# Altium project CT_Project.PrjPcb
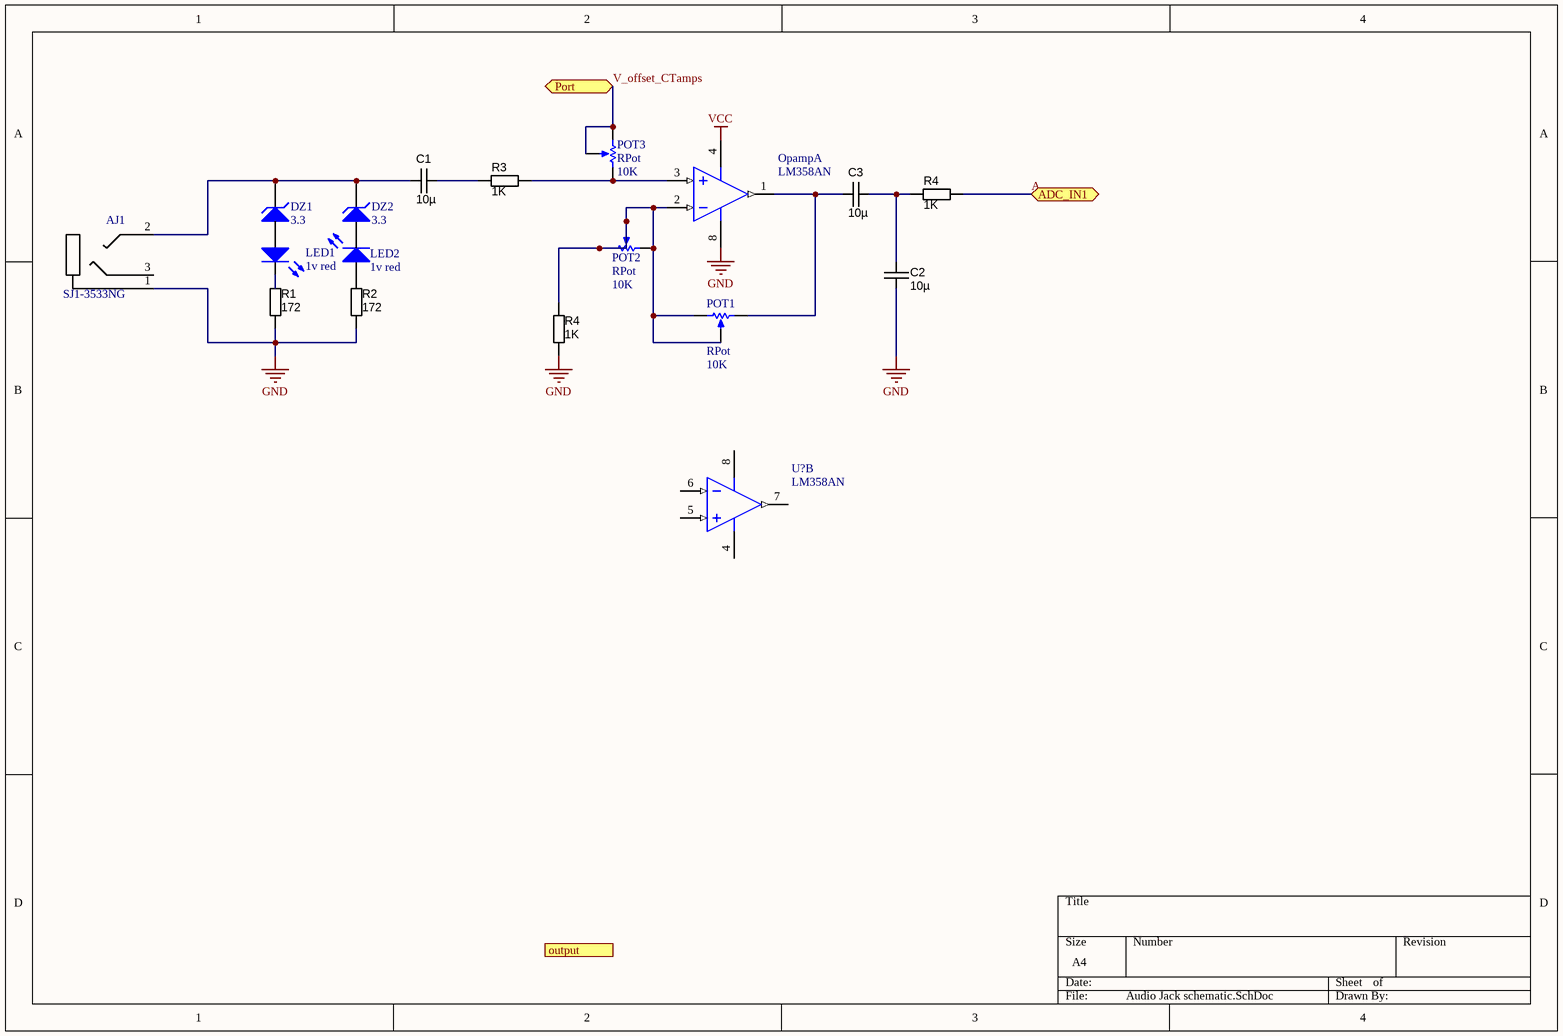
[diagram p0: Audio Jack schematic.SchDoc]
6 sheets, 38 parts. Net scope: flat (ports and power ports of the same name join across sheets).
Sheets:
  Audio Jack schematic.SchDoc
  MK20DXschematic.SchDoc
  Om Amp Level shifter schematic.SchDoc
  Open SDA schematic.SchDoc
  Power Supply schematic.SchDoc
  XBEEPROschematic.SchDoc

## Sheet Audio Jack schematic.SchDoc
size A4

### Parts
(Parts that share a designator on the sheet are numbered #1, #2 ... from top to bottom, then left to right.)
1v_red  LED2  [LED-1]
AJ1  SJ1-3533NG  [SJ1-3533NG]
C1#1  value 10µ  [CAPC2012N]  (hidden comment: approved sub OK)
C2#1  value 10µ  [CAPC2012N]  (hidden comment: approved sub OK)
C3  value 10µ  [CAPC2012N]  (hidden comment: approved sub OK)
DZ1#1  3.3  [DIODE-0.7]
DZ2  3.3  [DIODE-0.7]
LED1  1v red  [LED-1]
Opamp  LM358AN  [N08E]  (part A of 2)
POT1  RPot  value 10K  [VR5]
POT2  RPot  value 10K  [VR5]
POT3  RPot  value 10K  [VR5]
R1#1  value 172  [RESC2012N_ZERO]  (hidden comment: Thick Film)
R2#1  value 172  [RESC2012N_ZERO]  (hidden comment: Thick Film)
R3  value 1K  [RESC2012N_ZERO]  (hidden comment: Thick Film)
R4#1  value 1K  [RESC2012N_ZERO]  (hidden comment: Thick Film)
R4#2  value 1K  [RESC2012N_ZERO]  (hidden comment: Thick Film)
U?  LM358AN  [N08E]  (part B of 2)

### Ports
ADC_IN1, output, Port

### Nets
GND: AJ1.1(S) C2#1.2 Opamp.8(V+) R1#1.1 R2#1.1 R4#2.2
VCC: Opamp.4(GND)
A: R4#1.1 ; port ADC_IN1
V_offset_CTamps: POT3.1(TOP) POT3.3(TAP) ; port Port
NetAJ1_2: AJ1.2(T) C1#1.2 DZ1#1.2(K) DZ2.2(K)
NetC1#1_1: C1#1.1 R3.1
NetC2#1_1: C2#1.1 C3.2 R4#1.2
NetC3_1: C3.1 Opamp.1(OUTA) POT1.2(BOT)
NetLED1_2: LED1.2(K) R1#1.2
NetOpamp_2: Opamp.2(INA-) POT1.1(TOP) POT1.3(TAP) POT2.1(TOP) POT2.2(BOT) POT2.3(TAP) R4#2.1
NetOpamp_3: Opamp.3(INA+) POT3.2(BOT) R3.2

Not connected (* = marked no-connect by the designer): 1v_red 1(A) 2(K); AJ1 3(R); DZ1#1 1(A); DZ2 1(A); LED1 1(A); R2#1 2; U? 4(GND) 5(INB+) 6(INB-) 7(OUTB) 8(V+)

### Library data of the parts
1v_red LED1 = LED1: Typical RED GaAs LED; Published: 8-Jun-2000; LatestRevisionDate: 08-Jul-2005; LatestRevisionNote: Mech Layer 1 removed.; PackageReference: LED-1; Publisher: Altium Limited; PackageDescription: LED; 2 Leads
AJ1 = SJ1-3533NG: SJ1 Series 3.5 mm 12 V Right Angle Through Hole Isolated Stereo Audio Jack; MF: CUI; Availability: Good; Package: None; MP: SJ1-3533NG; Price: 0.77 USD; Value: *
C1#1 C2#1 C3 = CAPC_10u_0805_16V: Capacitor SMD Cer 10uF 10% 16V X7R 0805; Manufacturer 1: Samsung; Manufacturer Part Number 1: CL21B106KBN; Ratings: 16V; X7R; Material: ceramic; Package / Case: 0805 (2012 metric); Tolerance: ±10%
DZ1#1 DZ2 = D Zener: Zener Diode; Published: 8-Jun-2000; LatestRevisionDate: 17-Jul-2002; LatestRevisionNote: Re-released for DXP Platform.; PackageReference: DIODE-0.7; Publisher: Altium Limited; PackageDescription: Diode, Thru-Hole; 2 Leads; 0.7 in Pin Spacing
Opamp U? = CMP-0055-00164-2: Low Power Dual Operational Amplifier, 8-pin MDIP; Manufacturer: National Semiconductor; CompType: Amplifiers; PackageTopMarking: NSUZXYTTE#*LM*358AN; PowerWise: N; ComponentLink2Description: LM358 Web Page; Code_JEDEC: MS-001-BA; ComponentLink3Description: N08E Package Page; PinCount: 8; PackageReference: N08E; ComponentLink3URL: http://www.national.com/packaging/folders/n08e.html; PackageVersion: revG, May-2006; RevisionNote: Component URLs added; DatasheetVersion: Oct-2005; ComponentLink1URL: http://www.national.com/ds/LM/LM358.pdf; PackageDescription: MDIP, .365 x .250 x .130in, 8 Lead, .100in Pitch; ComponentLink2URL: http://www.national.com/pf/LM/LM358.html; ComponentLink1Description: LM358 Datasheet; RoHS: N
  Opamp: PartId: 1
  U?: PartId: 2
POT1-POT3 = RPot: Potentiometer; Sim Note: Enter the Resistance value and the set point into parameter fields.; Set Position: 0.5; Published: 8-Jun-2000; LatestRevisionDate: 17-Jul-2002; LatestRevisionNote: Re-released for DXP Platform.; PackageReference: VR5; Publisher: Altium Limited; PackageDescription: Variable Resistor, Thru-Hole; 3 Leads
R1#1 R2#1 R3 R4#1 R4#2 = RES_0R_0805: Resistor SMD chip 0.0 Ohm 0.125W 0805; Manufacturer 1: Rohm Semiconductor; Manufacturer Part Number 1: MCR10EZPJ000; Tolerance: ±5%; Ratings: 1/8W; Package / Case: 0805 (2012 metric)

## Sheet MK20DXschematic.SchDoc
size A4
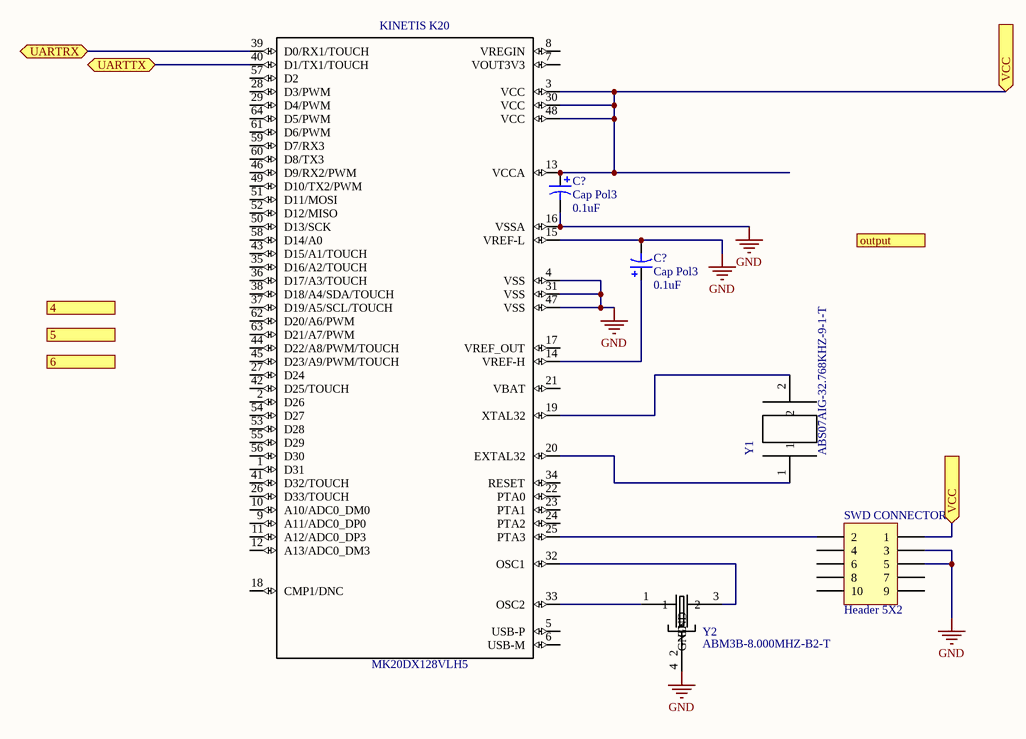
[diagram p1: MK20DXschematic.SchDoc]

### Parts
(Parts that share a designator on the sheet are numbered #1, #2 ... from top to bottom, then left to right.)
C?#1  Cap Pol3  value 0.1uF  [C0805]
C?#2  Cap Pol3  value 0.1uF  [C0805]
KINETIS_K20  MK20DX128VLH5  [QFP50P1200X1200X160-64N]
SWD_CONNECTOR  Header 5X2  [HDR2X5]
Y1  ABS07AIG-32.768KHZ-9-1-T  [XTAL320X150X90]
Y2  ABM3B-8.000MHZ-B2-T  [OSCSC500X320X110-4N]

### Ports
4, 5, 6, output, UARTRX (bidir), UARTTX (bidir), VCC (in)

### Nets
GND: C?#1.2 C?#2.2 KINETIS_K20.4(VSS) KINETIS_K20.15(VREF-L) KINETIS_K20.16(VSSA) KINETIS_K20.31(VSS) KINETIS_K20.47(VSS) SWD_CONNECTOR.3 SWD_CONNECTOR.5 Y2.4(GND)
NetC?#1_1: C?#1.1 KINETIS_K20.3(VCC) KINETIS_K20.13(VCCA) KINETIS_K20.30(VCC) KINETIS_K20.48(VCC) SWD_CONNECTOR.1 ; port VCC
NetC?#2_1: C?#2.1 KINETIS_K20.14(VREF-H)
NetKINETIS_K20_19: KINETIS_K20.19(XTAL32) Y1.2
NetKINETIS_K20_20: KINETIS_K20.20(EXTAL32) Y1.1
NetKINETIS_K20_25: KINETIS_K20.25(PTA3) SWD_CONNECTOR.2
NetKINETIS_K20_32: KINETIS_K20.32(OSC1) Y2.3(2)
NetKINETIS_K20_33: KINETIS_K20.33(OSC2) Y2.1
NetKINETIS_K20_39: KINETIS_K20.39(D0/RX1/TOUCH) ; port UARTRX
NetKINETIS_K20_40: KINETIS_K20.40(D1/TX1/TOUCH) ; port UARTTX

Not connected (* = marked no-connect by the designer): KINETIS_K20 1(D31) 2(D26) 5(USB-P) 6(USB-M) 7(VOUT3V3) 8(VREGIN) 9(A11/ADC0_DP0) 10(A10/ADC0_DM0) 11(A12/ADC0_DP3) 12(A13/ADC0_DM3) 17(VREF_OUT) 18(CMP1/DNC) 21(VBAT) 22(PTA0) 23(PTA1) 24(PTA2) 26(D33/TOUCH) 27(D24) 28(D3/PWM) 29(D4/PWM) 34(RESET) 35(D16/A2/TOUCH) 36(D17/A3/TOUCH) 37(D19/A5/SCL/TOUCH) 38(D18/A4/SDA/TOUCH) 41(D32/TOUCH) 42(D25/TOUCH) 43(D15/A1/TOUCH) 44(D22/A8/PWM/TOUCH) 45(D23/A9/PWM/TOUCH) 46(D9/RX2/PWM) 49(D10/TX2/PWM) 50(D13/SCK) 51(D11/MOSI) 52(D12/MISO) 53(D28) 54(D27) 55(D29) 56(D30) 57(D2) 58(D14/A0) 59(D7/RX3) 60(D8/TX3) 61(D6/PWM) 62(D20/A6/PWM) 63(D21/A7/PWM) 64(D5/PWM); SWD_CONNECTOR 4 6 7 8 9 10; Y2 2(GND)

### Library data of the parts
C?#1 C?#2 = Cap Pol3: Polarized Capacitor (Surface Mount); Published: 8-Jun-2000; LatestRevisionDate: 29-May-2009; LatestRevisionNote: IPC-7351 Footprint Added.; PackageReference: C0805; Publisher: Altium Limited; PackageDescription: Chip Capacitor
KINETIS_K20 = MK20DX128VLH5: MCU 32-bit Kinetis K20 ARM Cortex M4 RISC 128KB Flash 1.8V/2.5V/3.3V 64-Pin LQFP Tray; pin to pad: 17>none; MF: NXP Semiconductors; Package: LQFP-64 NXP Semiconductors; Price: 4.22 USD; MP: MK20DX128VLH5; Availability: Good; Value: *
SWD_CONNECTOR = Header 5X2: Header, 5-Pin, Dual row; LatestRevisionDate: 17-Jul-2002; LatestRevisionNote: Re-released for DXP Platform.; Publisher: Altium Limited
Y1 = ABS07AIG-32.768KHZ-9-1-T: Crystal 32.768khz 9pf Smd; MF: Abracon; MP: ABS07AIG-32.768KHZ-9-1-T; Package: SMD-2 Abracon; Availability: Good; Price: 0.53 USD; Value: *
Y2 = ABM3B-8.000MHZ-B2-T: Crystal 8MHz %C2%B120ppm %28Tol%29 %C2%B150ppm %28Stability%29 18pF FUND 200Ohm 4-Pin CSMD T/R; MF: Abracon; MP: ABM3B-8.000MHZ-B2-T; Package: SMD-4 Abracon; Availability: Good; Price: 0.45 USD; Value: *

## Sheet Om Amp Level shifter schematic.SchDoc
size A4
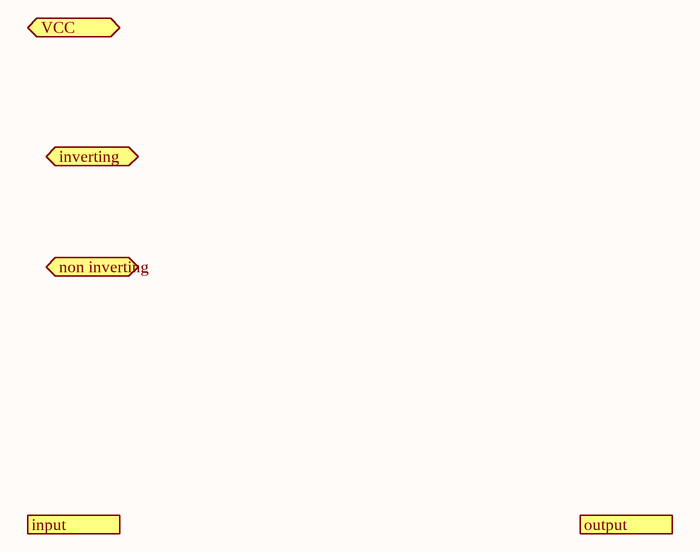
[diagram p2: Om Amp Level shifter schematic.SchDoc]

### Ports
input, inverting, non inverting, output, VCC

## Sheet Open SDA schematic.SchDoc
size A4
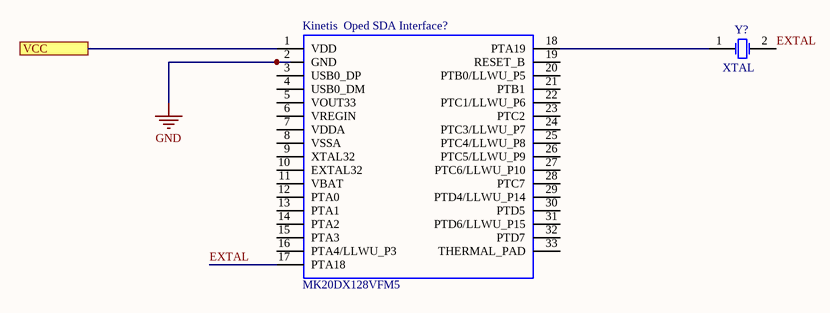
[diagram p3: Open SDA schematic.SchDoc]

### Parts
Kinetis_Oped_SDA_Interface?  MK20DX128VFM5  [SOT617-14]
Y?  XTAL  [R38]

### Ports
VCC

### Nets
GND: Kinetis_Oped_SDA_Interface?.2(GND)
EXTAL: Kinetis_Oped_SDA_Interface?.17(PTA18) Y?.2(OSC2)
NetC?#1_1: Kinetis_Oped_SDA_Interface?.1(VDD) ; port VCC
NetKinetis_Oped_SDA_Interface?_18: Kinetis_Oped_SDA_Interface?.18(PTA19) Y?.1(OSC1)

Not connected (* = marked no-connect by the designer): Kinetis_Oped_SDA_Interface? 3(USB0_DP) 4(USB0_DM) 5(VOUT33) 6(VREGIN) 7(VDDA) 8(VSSA) 9(XTAL32) 10(EXTAL32) 11(VBAT) 12(PTA0) 13(PTA1) 14(PTA2) 15(PTA3) 16(PTA4/LLWU_P3) 19(RESET_B) 20(PTB0/LLWU_P5) 21(PTB1) 22(PTC1/LLWU_P6) 23(PTC2) 24(PTC3/LLWU_P7) 25(PTC4/LLWU_P8) 26(PTC5/LLWU_P9) 27(PTC6/LLWU_P10) 28(PTC7) 29(PTD4/LLWU_P14) 30(PTD5) 31(PTD6/LLWU_P15) 32(PTD7) 33(THERMAL_PAD)

### Library data of the parts
Kinetis_Oped_SDA_Interface? = MK20DX128VFM5: MCU, Kinetis, MK20DX128VFM5, QFN32 Freescale MK20DX128VFM5, 32bit ARM Cortex M4 MCU, 50MHz, 160 kB Flash, 32-Pin QFN; Manufacturer_Name: NXP; Geometry.Height: mm; Supplier_Name: RS; RS Part Number: 8181223; Manufacturer_Part_Number: MK20DX128VFM5; Allied_Number: *; Other Part Number: *; Datasheet Link: http://www.nxp.com/docs/en/data-sheet/K20P32M50SF0.pdf; 3D Package: *
Y? = XTAL: Crystal Oscillator; Published: 8-Jun-2000; LatestRevisionDate: 17-Jul-2002; LatestRevisionNote: Re-released for DXP Platform.; PackageReference: R38; Publisher: Altium Limited; PackageDescription: Crystal, Thru-Hole; 2 Leads; Body 3.1 x 8.2 mm (Dia.xH)

## Sheet Power Supply schematic.SchDoc
size A4
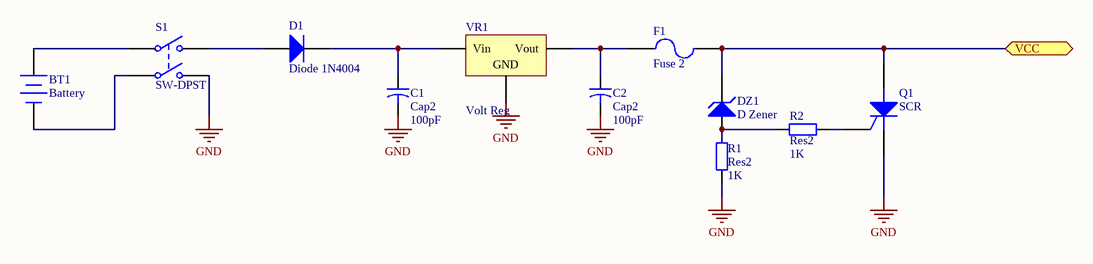
[diagram p4: Power Supply schematic.SchDoc]

### Parts
(Parts that share a designator on the sheet are numbered #1, #2 ... from top to bottom, then left to right.)
BT1  Battery  [BAT-2]
C1#2  Cap2  value 100pF  [CAPR5-4X5]
C2#2  Cap2  value 100pF  [CAPR5-4X5]
D1  Diode 1N4004  [DO-41]
DZ1#2  D Zener  [DIODE-0.7]
F1  Fuse 2  [PIN-W2/E2.8]
Q1  SCR  [TO-220-AB]
R1#2  Res2  value 1K  [AXIAL-0.4]
R2#2  Res2  value 1K  [AXIAL-0.4]
S1  SW-DPST  [DPST-4]
VR1  Volt Reg  [D2PAK_N]

### Ports
VCC

### Nets
GND: C1#2.2 C2#2.2 Q1.3(K) R1#2.1 S1.4(NO2) VR1.2(GND)
NetBT1_1: BT1.1(+) S1.1(COMMON1)
NetBT1_2: BT1.2(-) S1.3(COMMON2)
NetC1#2_1: C1#2.1 D1.2(K) VR1.1(Vin)
NetC2#2_1: C2#2.1 F1.1 VR1.3(Vout)
NetC?#1_1: DZ1#2.2(K) F1.2 Q1.1(A) ; port VCC
NetD1_1: D1.1(A) S1.2(NO1)
NetDZ1#2_1: DZ1#2.1(A) R1#2.2 R2#2.2
NetQ1_2: Q1.2(G) R2#2.1

### Library data of the parts
BT1 = Battery: Multicell Battery; Published: 24-Mar-1999; LatestRevisionDate: 17-Jul-2002; LatestRevisionNote: Re-released for DXP Platform.; PackageReference: BAT-2; Publisher: Altium Limited; PackageDescription: Battery; 2 Leads
C1#2 C2#2 = Cap2: Capacitor; Published: 23-Sep-2002; PackageReference: CAPR5-4X5; Publisher: Altium Limited; PackageDescription: Capacitor; 2 Leads
D1 = Diode 1N4004: 1 Amp General Purpose Rectifier; Published: 8-Jun-2000; LatestRevisionDate: 17-Jul-2002; LatestRevisionNote: Re-released for DXP Platform.; DatasheetVersion: 1998; PackageVersion: Aug-1999; PackageReference: DO-41; Publisher: Altium Limited; PackageDescription: Diode, Axial; Body 5.2 x 2.7 mm (LxDia. max), Lead Dia. 0.86 mm (max); Code_JEDEC: DO-204-AL; ComponentLink1Description: Manufacturer Link; ComponentLink1URL: http://www.fairchildsemi.com/; ComponentLink2Description: Datasheet; ComponentLink2URL: http://www.fairchildsemi.com/ds/1N%2F1N4001.pdf
DZ1#2 = D Zener: Zener Diode; Published: 8-Jun-2000; LatestRevisionDate: 17-Jul-2002; LatestRevisionNote: Re-released for DXP Platform.; PackageReference: DIODE-0.7; Publisher: Altium Limited; PackageDescription: Diode, Thru-Hole; 2 Leads; 0.7 in Pin Spacing
F1 = Fuse 2: Fuse; Published: 8-Jun-2000; LatestRevisionDate: 17-Jul-2002; LatestRevisionNote: Re-released for DXP Platform.; PackageReference: PIN-W2/E2.8; Publisher: Altium Limited; PackageDescription: Thru-Hole; 2 Leads
Q1 = SCR: Silicon Controlled Rectifier; Published: 8-Jun-2000; LatestRevisionDate: 17-Jul-2002; LatestRevisionNote: Re-released for DXP Platform.; PackageReference: TO-220-AB; Publisher: Altium Limited; Code_JEDEC: TO-220-AB
R1#2 R2#2 = Res2: Resistor; Published: 8-Jun-2000; LatestRevisionDate: 17-Jul-2002; LatestRevisionNote: Re-released for DXP Platform.; PackageReference: AXIAL-0.4; Publisher: Altium Limited; PackageDescription: Axial Device, Thru-Hole; 2 Leads; 0.4 in Pin Spacing
S1 = SW-DPST: Double-Pole, Single-Throw Switch; Published: 24-Mar-1999; LatestRevisionDate: 17-Jul-2002; LatestRevisionNote: Re-released for DXP Platform.; PackageReference: DPST-4; Publisher: Altium Limited; PackageDescription: Switch; 4 Leads
VR1 = Volt Reg: Voltage Regulator; Published: 24-Mar-1999; LatestRevisionDate: 29-May-2009; LatestRevisionNote: IPC-7351 Footprint Added.; PackageReference: D2PAK; Publisher: Altium Limited; PackageDescription: 3-Pin Transistor Outline Package 2.54 mm Pitch, 15.1 mm Lead Span

## Sheet XBEEPROschematic.SchDoc
size A4
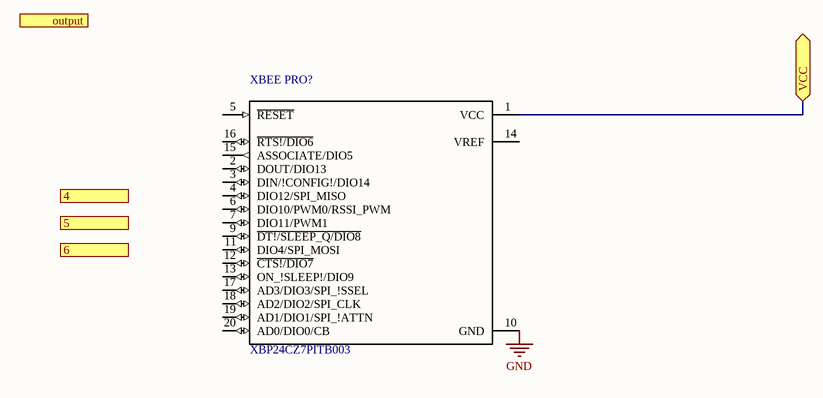
[diagram p5: XBEEPROschematic.SchDoc]

### Parts
XBEE_PRO?  XBP24CZ7PITB003  [DIP2200W51P200L3294H279Q20P]

### Ports
4, 5, 6, output, VCC

### Nets
GND: XBEE_PRO?.10(GND)
NetC?#1_1: XBEE_PRO?.1(VCC) ; port VCC

Not connected (* = marked no-connect by the designer): XBEE_PRO? 2(DOUT/DIO13) 3(DIN/!CONFIG!/DIO14) 4(DIO12/SPI_MISO) 5(~{RESET}) 6(DIO10/PWM0/RSSI_PWM) 7(DIO11/PWM1) 9(~{D}T~{!/SLEEP}_~{Q/DIO8}) 11(DIO4/SPI_MOSI) 12(~{CTS!/DIO7}) 13(ON_!SLEEP!/DIO9) 14(VREF) 15(ASSOCIATE/DIO5) 16(~{RTS!/DIO6}) 17(AD3/DIO3/SPI_!SSEL) 18(AD2/DIO2/SPI_CLK) 19(AD1/DIO1/SPI_!ATTN) 20(AD0/DIO0/CB)

### Library data of the parts
XBEE_PRO? = XBP24CZ7PITB003: Programmable Xbee-Pro Zb S2c Th %28Pcb Antenna%29; MF: Digi International; Package: Module Digi International; Price: 31.31 USD; MP: XBP24CZ7PITB003; Availability: Bad; Value: *

## Nets that join several sheets
GND: Audio Jack schematic (6 pins), MK20DXschematic (10 pins), Open SDA schematic (Kinetis_Oped_SDA_Interface?.2), Power Supply schematic (6 pins), XBEEPROschematic (XBEE_PRO?.10)
NetC?#1_1: MK20DXschematic (6 pins), Open SDA schematic (Kinetis_Oped_SDA_Interface?.1), Power Supply schematic (DZ1#2.2 F1.2 Q1.1), XBEEPROschematic (XBEE_PRO?.1)